# EAGLE design singleHbridge-v1 (EAGLE 7.1.0)
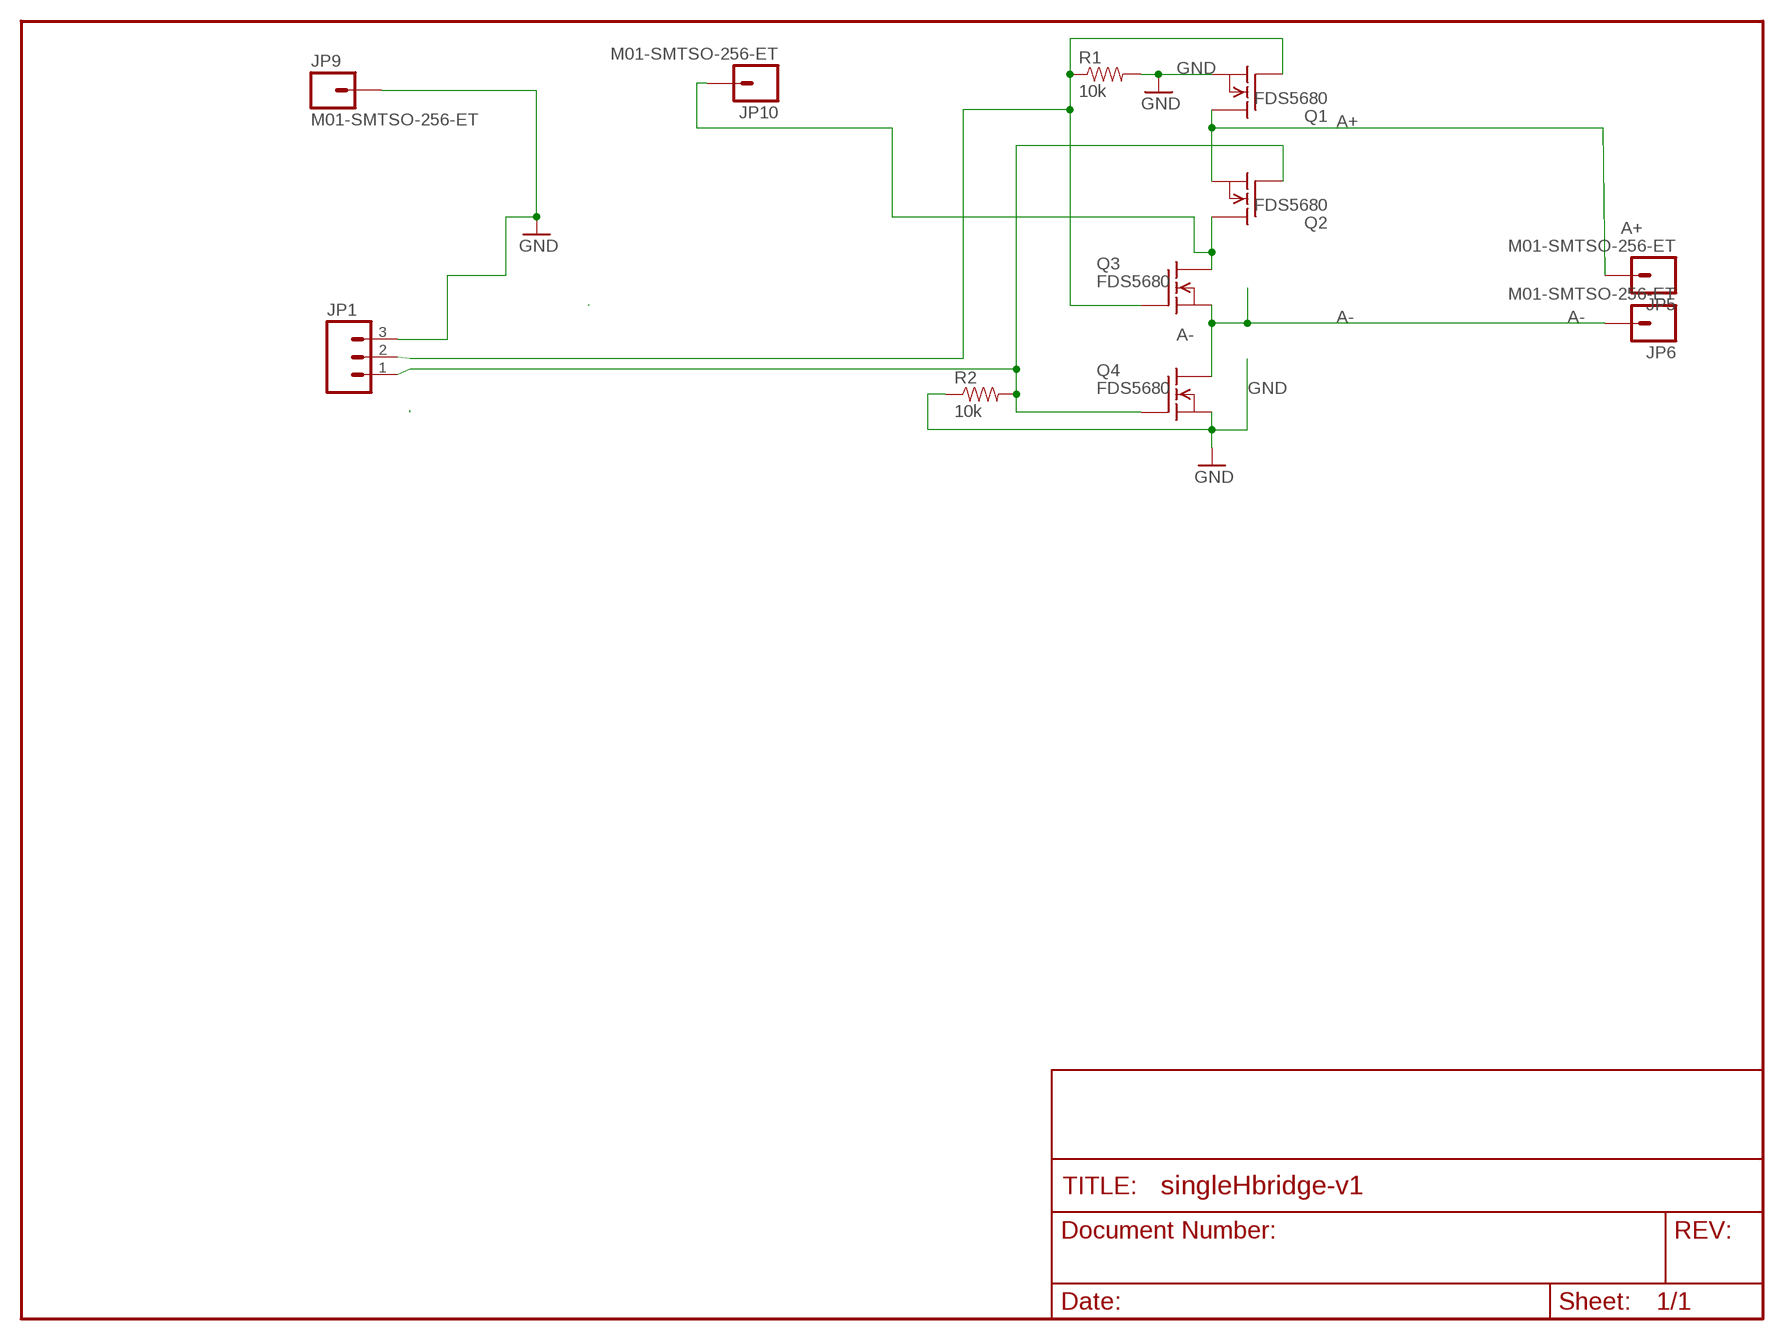
[diagram p0: schematic, sheet 1]

## Parts
JP1  M03PTH  [1X03]
JP5  M01-SMTSO-256-ET  [SMTSO-256-ET]
JP6  M01-SMTSO-256-ET  [SMTSO-256-ET]
JP9  M01-SMTSO-256-ET  [SMTSO-256-ET]
JP10  M01-SMTSO-256-ET  [SMTSO-256-ET]
Q1  FDS5680  [SO-8]
Q2  FDS5680  [SO-8]
Q3  FDS5680  [SO-8]
Q4  FDS5680  [SO-8]
R1  10k  RESISTOR0603-RES  [0603-RES]
R2  10k  RESISTOR0603-RES  [0603-RES]

## Nets
12V: JP10.P$1 Q2.5(D) Q2.6(D) Q2.7(D) Q2.8(D) Q3.5(D) Q3.6(D) Q3.7(D) Q3.8(D)
A+: JP5.P$1 Q1.5(D) Q1.6(D) Q1.7(D) Q1.8(D) Q2.1(S) Q2.2(S) Q2.3(S)
A-: JP6.P$1 Q3.1(S) Q3.2(S) Q3.3(S) Q4.5(D) Q4.6(D) Q4.7(D) Q4.8(D)
GND: JP1.3 JP9.P$1 Q1.1(S) Q1.2(S) Q1.3(S) Q4.1(S) Q4.2(S) Q4.3(S) R1.2 R2.1
N$6: JP1.2 Q1.4(G) Q3.4(G) R1.1
N$7: JP1.1 Q2.4(G) Q4.4(G) R2.2

## Library data of the parts
JP1 = SparkFun-Connectors:M03: Header 3 Standard 3-pin 0.1" header. Use with straight break away headers (SKU : PRT-00116), right angle break away headers (PRT-00553), swiss pins (PRT-00743), machine pins (PRT-00117), and female headers (PRT-00115). Molex polarized connector foot print use with SKU : PRT-08232 with associated crimp pins and housings.
JP5 JP6 JP9 JP10 = SparkFun-Connectors:M01: Header 1 Standard 1-pin 0.1" header. Use with straight break away headers (SKU : PRT-00116), right angle break away headers (PRT-00553), swiss pins (PRT-00743), machine pins (PRT-00117), and female headers (PRT-00115).
Q1-Q4 = transistor-fet:FDS5680: 60V N-Channel PowerTrench TM MOSFET FAIRCHILD FDS5680.pdf
R1 R2 = SparkFun-Passives:RESISTOR: Resistor Basic schematic elements and footprints for 0603, 1206, and PTH resistors.

## Net classes
0 default: width 0.203 mm
1 vcc: width 0.254 mm

## Board
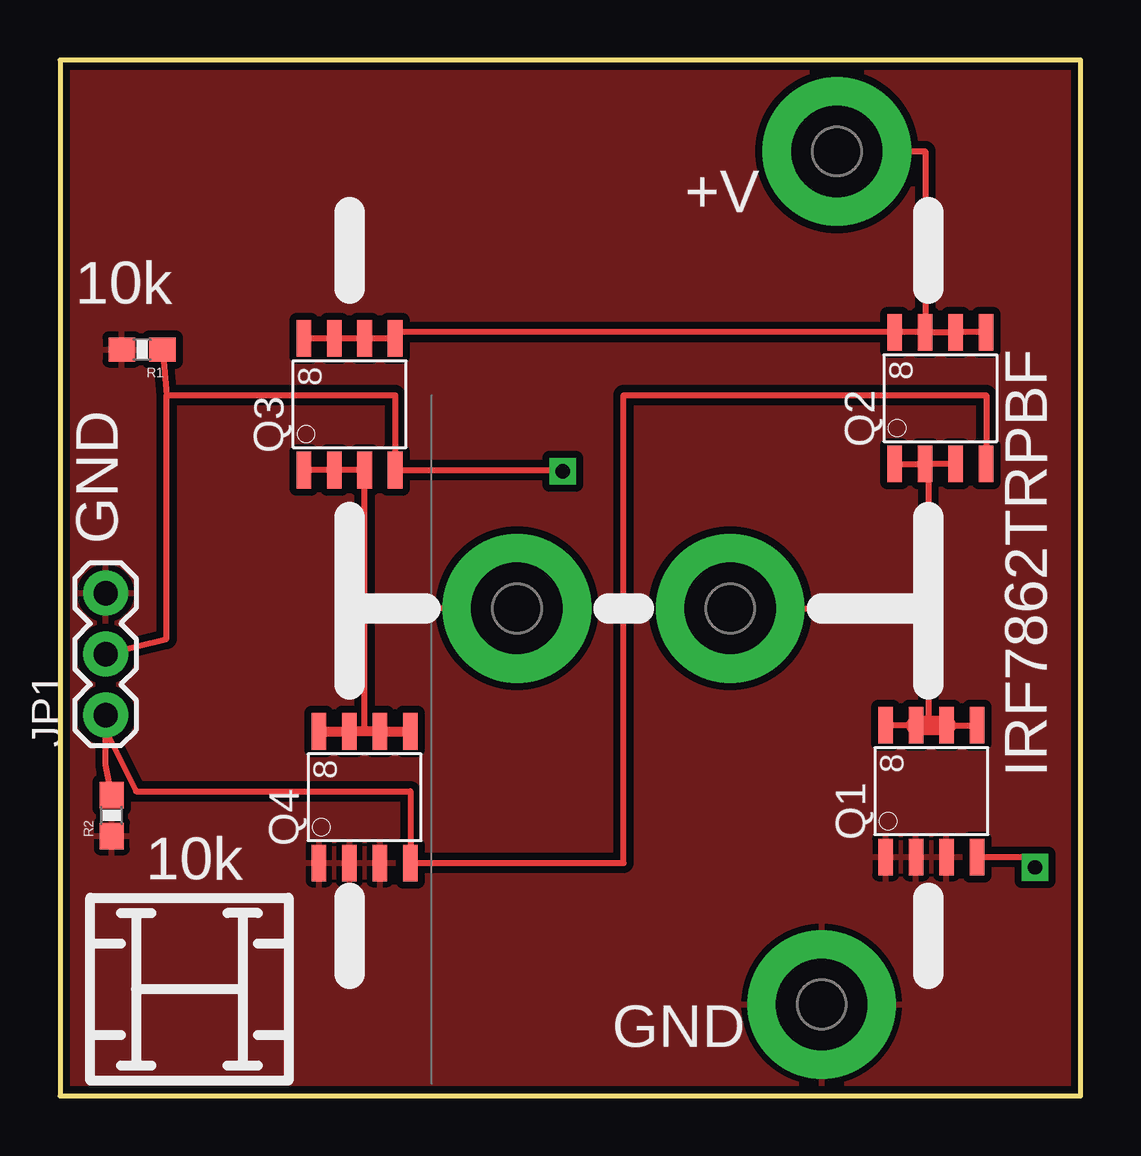
[diagram p1: board, top side]
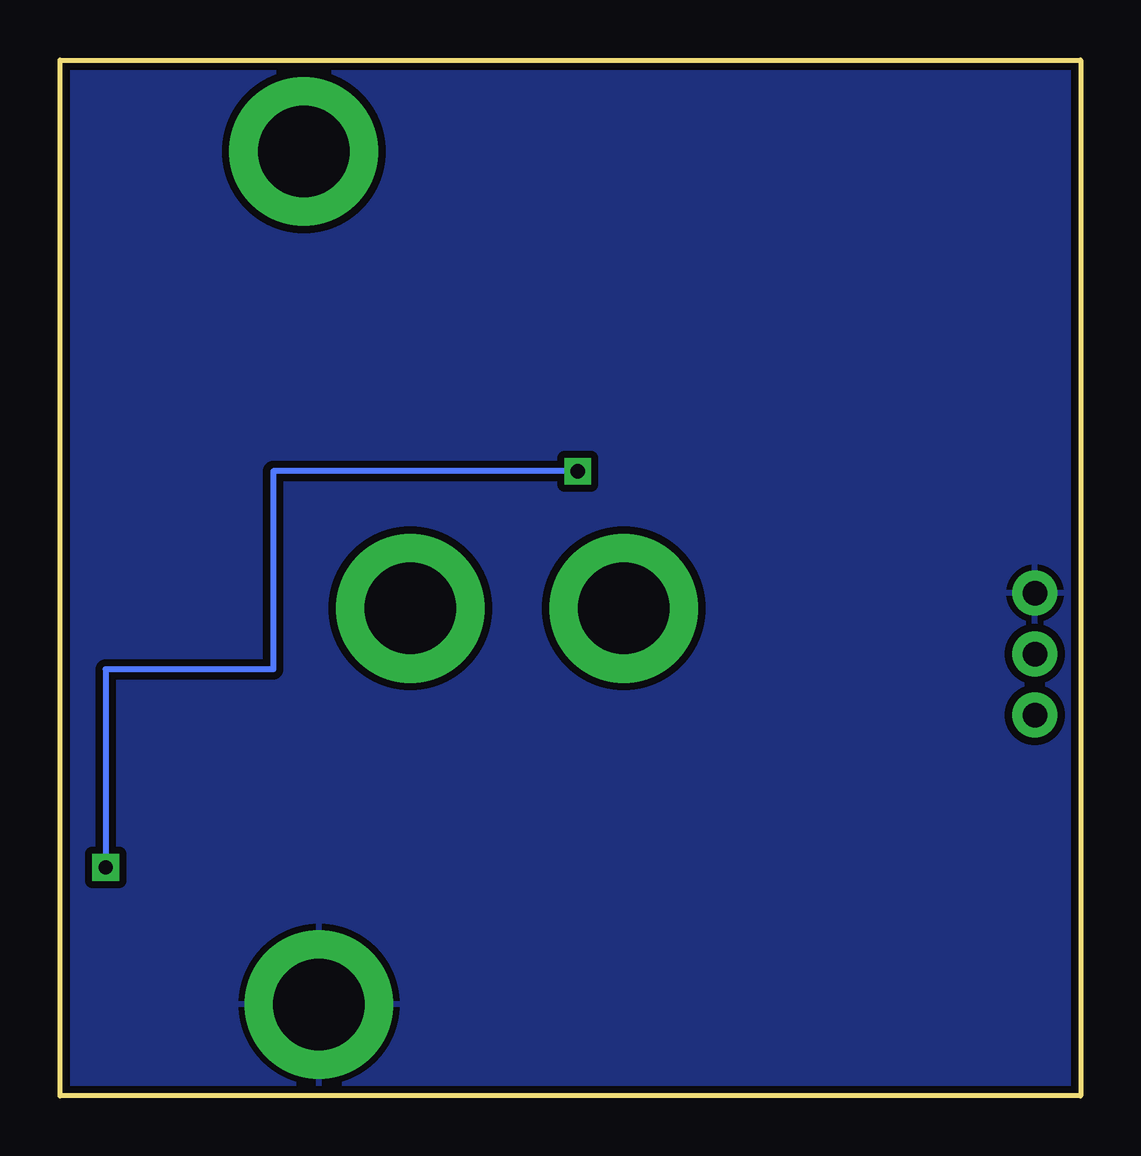
[diagram p2: board, bottom side, seen from below]

Size 42.55 x 43.18 mm. Coordinates in mm from the lower left corner, seen from the top.
Outline: 0,43.18 0,0 42.55,0 42.55,43.18 0,43.18
Copper layers (1*16): Top 0.035mm / dielectric 1.5mm / Bottom 0.035mm
Design rules "SparkFun": minimum track width 8mil, minimum drill 20mil, track to track 8mil, track to pad 8mil, pad to pad 8mil, via to via 8mil, smd to smd 8mil, copper to edge 10mil, drill to drill 8mil, minimum pad ring 12mil, minimum via ring 10mil, stop-mask expansion 4mil, vias tented up to drill 25mil, thermal gap 10mil

### Footprints (pad centres in the part's own frame; a part is rotated, then mirrored left to right if it is on the bottom)
1X03 = drill 1.016 pad 1.88: 1 0,0; 2 2.54,0; 3 5.08,0
SMTSO-256-ET = drill 3.81 pad 6.198: P$1 0,0
SO-8 = smd 1.524 x 0.61: 1 -2.743,1.905; 2 -2.743,0.635; 3 -2.743,-0.635; 4 -2.743,-1.905; 5 2.743,-1.905; 6 2.743,-0.635; 7 2.743,0.635; 8 2.743,1.905
0603-RES = smd 1.1 x 1: 1 -0.85,0; 2 0.85,0

### Placement (x,y rotation side)
JP1  1.91,15.88 90 top
JP5  27.94,20.32 0 top
JP6  19.05,20.32 0 top
JP9  31.75,3.81 0 top
JP10  32.38,39.37 0 top
Q1  36.32,12.7 90 top
Q2  36.7,29.08 90 top
Q3  12.06,28.83 90 top
Q4  12.7,12.45 90 top
R1  3.43,31.11 180 top
R2  2.16,11.68 90 top

### Tracks (layer width: path | path; a pad name or v marks a point on that pad's centre or on a via)
12V
  Top 0.254: JP10.P$1 36.07,39.37 Q2.7 | Q2.7 Q2.6 Q2.5 | Q2.7 Q2.8 13.97,31.83 Q3.5 Q3.6 Q3.7 Q3.8
A+
  Top 0.254: Q1.7 Q1.8 | Q1.6 Q1.5 | Q2.3 Q2.2 Q2.1 36.2,26.34 36.2,20.32 | 36.2,20.32 36.2,15.44 | JP5.P$1 36.2,20.32
  Top 0.813: Q1.6 36.2,15.44 Q1.7
A-
  Top 0.254: JP6.P$1 12.7,20.32 | 12.7,20.32 Q3.3 Q3.2 Q3.1 | Q4.5 12.7,15.19 12.7,20.32
  Top 0.406: Q4.8 Q4.7 Q4.6 Q4.5
GND
  pour Top (isolate 0.305): 0,43.18 42.55,43.18 42.55,0 0,0
  pour Bottom (isolate 0.305): 0,43.18 42.55,43.18 42.55,0 0,0
N$6  (via drill 0.6)
  Top 0.254: JP1.2 4.45,19.05 4.45,29.21 | 4.45,29.21 13.97,29.21 Q3.4 20.95,26.09 v20.95,26.04 | R1.1 4.45,29.21 | Q1.4 40.64,9.96 v40.64,9.53
  Bottom 0.254: v20.95,26.04 33.66,26.04 33.66,17.78 40.64,17.78 v40.64,9.53
N$7
  Top 0.254: JP1.1 1.91,15.24 | 1.91,15.24 3.17,12.7 14.61,12.7 Q4.4 23.5,9.7 23.5,29.21 38.61,29.21 Q2.4 | R2.2 1.91,13.8 1.91,15.24

### Text on the board
tPlace: +V | 10k | IRF7862TRPBF | GND | 10k | GND
tValues: Tent Vias! | Arduino Wee v1.3